# Altium schematic sheet DAQ_v1.SchDoc: DAQ Top Sheet
size A; DocumentNumber: 1; SheetNumber: 1; SheetTotal: 9
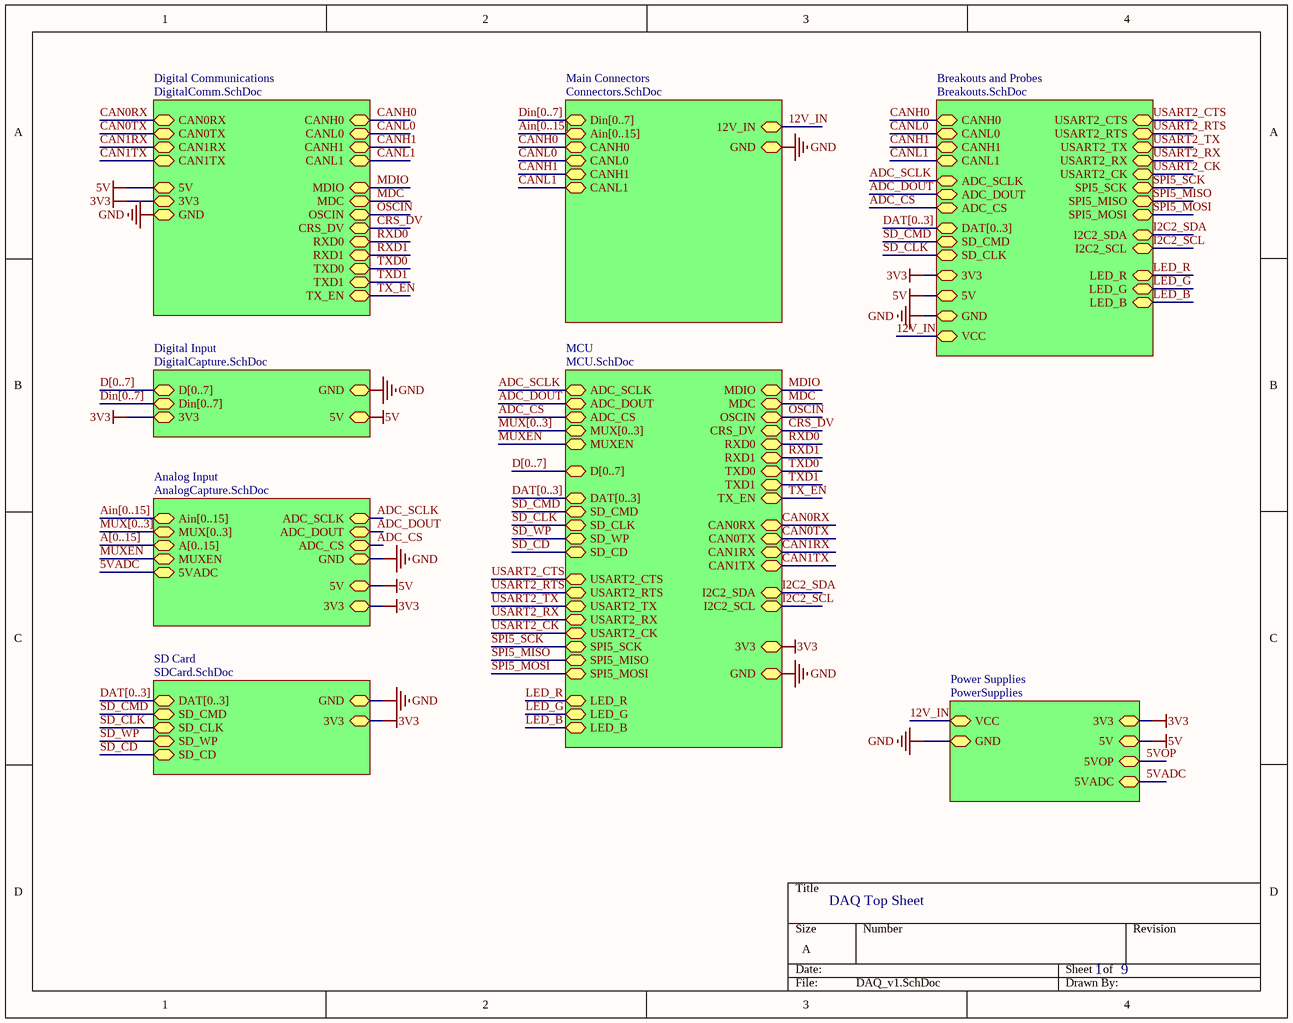
[diagram p0: DAQ_v1.SchDoc]

## Sub-sheets
Analog Input = AnalogCapture.SchDoc: Ain[0..15], MUX[0..3], MUXEN, 5VADC, 5V, 3V3, ADC_SCLK, ADC_DOUT, ADC_CS, GND, A[0..15]
Breakouts and Probes = Breakouts.SchDoc: CANH0, CANL0, CANH1, CANL1, ADC_SCLK, ADC_DOUT, ADC_CS, DAT[0..3], SD_CMD, SD_CLK, USART2_CTS, USART2_RTS, USART2_TX, USART2_RX, USART2_CK, SPI5_SCK, SPI5_MISO, SPI5_MOSI, I2C2_SDA, I2C2_SCL, LED_R, LED_G, LED_B, 3V3, 5V, GND, VCC
Digital Communications = DigitalComm.SchDoc: 5V, 3V3, GND, CAN1TX, CAN1RX, CAN0TX, CAN0RX, CANH0, CANL0, CANH1, CANL1, MDIO, MDC, OSCIN, CRS_DV, RXD0, RXD1, TXD0, TXD1, TX_EN
Digital Input = DigitalCapture.SchDoc: D[0..7], Din[0..7], 3V3, GND, 5V
Main Connectors = Connectors.SchDoc: Din[0..7], Ain[0..15], CANH0, CANL0, CANH1, CANL1, 12V_IN, GND
MCU = MCU.SchDoc: MDIO, MDC, OSCIN, CRS_DV, RXD0, RXD1, TXD0, TXD1, TX_EN, ADC_SCLK, ADC_DOUT, ADC_CS, D[0..7], 3V3, GND, CAN1TX, CAN1RX, CAN0TX, CAN0RX, DAT[0..3], SD_CMD, SD_CLK, SD_WP, SD_CD, MUX[0..3], MUXEN, USART2_CTS, USART2_RTS, USART2_TX, USART2_RX, USART2_CK, SPI5_SCK, SPI5_MISO, SPI5_MOSI, I2C2_SDA, I2C2_SCL, LED_R, LED_G, LED_B
Power Supplies = PowerSupplies: 3V3, 5V, 5VOP, 5VADC, VCC, GND
SD Card = SDCard.SchDoc: 3V3, GND, DAT[0..3], SD_CMD, SD_CLK, SD_WP, SD_CD

## Nets
3V3: sheet Power Supplies/3V3, sheet Analog Input/3V3, sheet Digital Communications/3V3, sheet Digital Input/3V3, sheet MCU/3V3, sheet SD Card/3V3, sheet Breakouts and Probes/3V3
5V: sheet Power Supplies/5V, sheet Analog Input/5V, sheet Digital Communications/5V, sheet Digital Input/5V, sheet Breakouts and Probes/5V
GND: sheet Power Supplies/GND, sheet Analog Input/GND, sheet Digital Communications/GND, sheet Digital Input/GND, sheet Main Connectors/GND, sheet MCU/GND, sheet SD Card/GND, sheet Breakouts and Probes/GND
5VADC: sheet Power Supplies/5VADC, sheet Analog Input/5VADC
5VOP: sheet Power Supplies/5VOP
12V_IN: sheet Power Supplies/VCC, sheet Main Connectors/12V_IN, sheet Breakouts and Probes/VCC
ADC_CS: sheet Analog Input/ADC_CS, sheet MCU/ADC_CS, sheet Breakouts and Probes/ADC_CS
ADC_DOUT: sheet Analog Input/ADC_DOUT, sheet MCU/ADC_DOUT, sheet Breakouts and Probes/ADC_DOUT
ADC_SCLK: sheet Analog Input/ADC_SCLK, sheet MCU/ADC_SCLK, sheet Breakouts and Probes/ADC_SCLK
CAN0RX: sheet Digital Communications/CAN0RX, sheet MCU/CAN0RX
CAN0TX: sheet Digital Communications/CAN0TX, sheet MCU/CAN0TX
CAN1RX: sheet Digital Communications/CAN1RX, sheet MCU/CAN1RX
CAN1TX: sheet Digital Communications/CAN1TX, sheet MCU/CAN1TX
CANH0: sheet Digital Communications/CANH0, sheet Main Connectors/CANH0, sheet Breakouts and Probes/CANH0
CANH1: sheet Digital Communications/CANH1, sheet Main Connectors/CANH1, sheet Breakouts and Probes/CANH1
CANL0: sheet Digital Communications/CANL0, sheet Main Connectors/CANL0, sheet Breakouts and Probes/CANL0
CANL1: sheet Digital Communications/CANL1, sheet Main Connectors/CANL1, sheet Breakouts and Probes/CANL1
CRS_DV: sheet Digital Communications/CRS_DV, sheet MCU/CRS_DV
I2C2_SCL: sheet MCU/I2C2_SCL, sheet Breakouts and Probes/I2C2_SCL
I2C2_SDA: sheet MCU/I2C2_SDA, sheet Breakouts and Probes/I2C2_SDA
LED_B: sheet MCU/LED_B, sheet Breakouts and Probes/LED_B
LED_G: sheet MCU/LED_G, sheet Breakouts and Probes/LED_G
LED_R: sheet MCU/LED_R, sheet Breakouts and Probes/LED_R
MDC: sheet Digital Communications/MDC, sheet MCU/MDC
MDIO: sheet Digital Communications/MDIO, sheet MCU/MDIO
MUXEN: sheet Analog Input/MUXEN, sheet MCU/MUXEN
OSCIN: sheet Digital Communications/OSCIN, sheet MCU/OSCIN
RXD0: sheet Digital Communications/RXD0, sheet MCU/RXD0
RXD1: sheet Digital Communications/RXD1, sheet MCU/RXD1
SD_CD: sheet MCU/SD_CD, sheet SD Card/SD_CD
SD_CLK: sheet MCU/SD_CLK, sheet SD Card/SD_CLK, sheet Breakouts and Probes/SD_CLK
SD_CMD: sheet MCU/SD_CMD, sheet SD Card/SD_CMD, sheet Breakouts and Probes/SD_CMD
SD_WP: sheet MCU/SD_WP, sheet SD Card/SD_WP
SPI5_MISO: sheet MCU/SPI5_MISO, sheet Breakouts and Probes/SPI5_MISO
SPI5_MOSI: sheet MCU/SPI5_MOSI, sheet Breakouts and Probes/SPI5_MOSI
SPI5_SCK: sheet MCU/SPI5_SCK, sheet Breakouts and Probes/SPI5_SCK
TX_EN: sheet Digital Communications/TX_EN, sheet MCU/TX_EN
TXD0: sheet Digital Communications/TXD0, sheet MCU/TXD0
TXD1: sheet Digital Communications/TXD1, sheet MCU/TXD1
USART2_CK: sheet MCU/USART2_CK, sheet Breakouts and Probes/USART2_CK
USART2_CTS: sheet MCU/USART2_CTS, sheet Breakouts and Probes/USART2_CTS
USART2_RTS: sheet MCU/USART2_RTS, sheet Breakouts and Probes/USART2_RTS
USART2_RX: sheet MCU/USART2_RX, sheet Breakouts and Probes/USART2_RX
USART2_TX: sheet MCU/USART2_TX, sheet Breakouts and Probes/USART2_TX

## Buses and harness runs
bus A[0..15] = sheet Analog Input/A[0..15]
bus Ain[0..15] = sheet Analog Input/Ain[0..15]
bus Ain[0..15] = sheet Main Connectors/Ain[0..15]
bus D[0..7] = sheet Digital Input/D[0..7]
bus D[0..7] = sheet MCU/D[0..7]
bus DAT[0..3] = sheet Breakouts and Probes/DAT[0..3]
bus DAT[0..3] = sheet MCU/DAT[0..3]
bus DAT[0..3] = sheet SD Card/DAT[0..3]
bus Din[0..7] = sheet Digital Input/Din[0..7]
bus Din[0..7] = sheet Main Connectors/Din[0..7]
bus MUX[0..3] = sheet Analog Input/MUX[0..3]
bus MUX[0..3] = sheet MCU/MUX[0..3]